# Altium schematic sheet LD0.SchDoc
size A; SheetNumber: 1; SheetTotal: 1
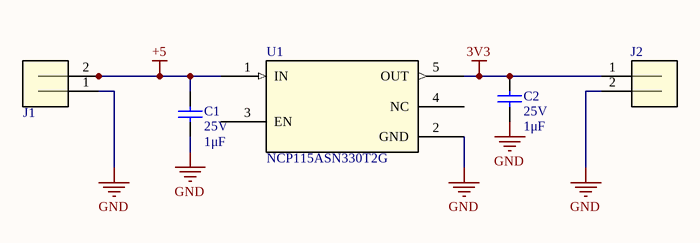
[diagram p0: LD0.SchDoc]

## Parts
C1  value 1μF  Voltage Rating: 25V  [CAP0805]  (hidden comment: GCM21BR71E105KA56L)
C2  value 1μF  Voltage Rating: 25V  [CAP0805]  (hidden comment: GCM21BR71E105KA56L)
J1  22053021  [CONN2_5-3021_MOL]  (value not drawn)
J2  22053021  [CONN2_5-3021_MOL]  (value not drawn)
U1  NCP115ASN330T2G  [TSOP-5-483-N_ONS]

## Nets
3V3: C2.2 J2.1 U1.5(OUT)
+5: C1.2 J1.2 U1.1(IN)
GND: C1.1 C2.1 J1.1 J2.2 U1.2(GND)

Not connected (* = marked no-connect by the designer): U1 3(EN) 4(NC)

## Library data of the parts
C1 C2 = GCM21BR71E105KA56L: CAP CER 1UF 25V X7R 0805; Manufacturer 1: Murata; Supplier 1: Digi-Key; Manufacturer Part Number 1: GCM21BR71E105KA56L; Supplier Part Number 1: 490-4785-1-ND
J1 J2 = 22053021: No Description Available; Mfr_Name: Molex Connector Corporation; RefDes: RefDes; Type: Type
U1 = NCP115ASN330T2G: No Description Available; Mfr_Name: onsemi; RefDes: RefDes; Type: Type